# EAGLE design Particle-Gateway (EAGLE 7.3.0)
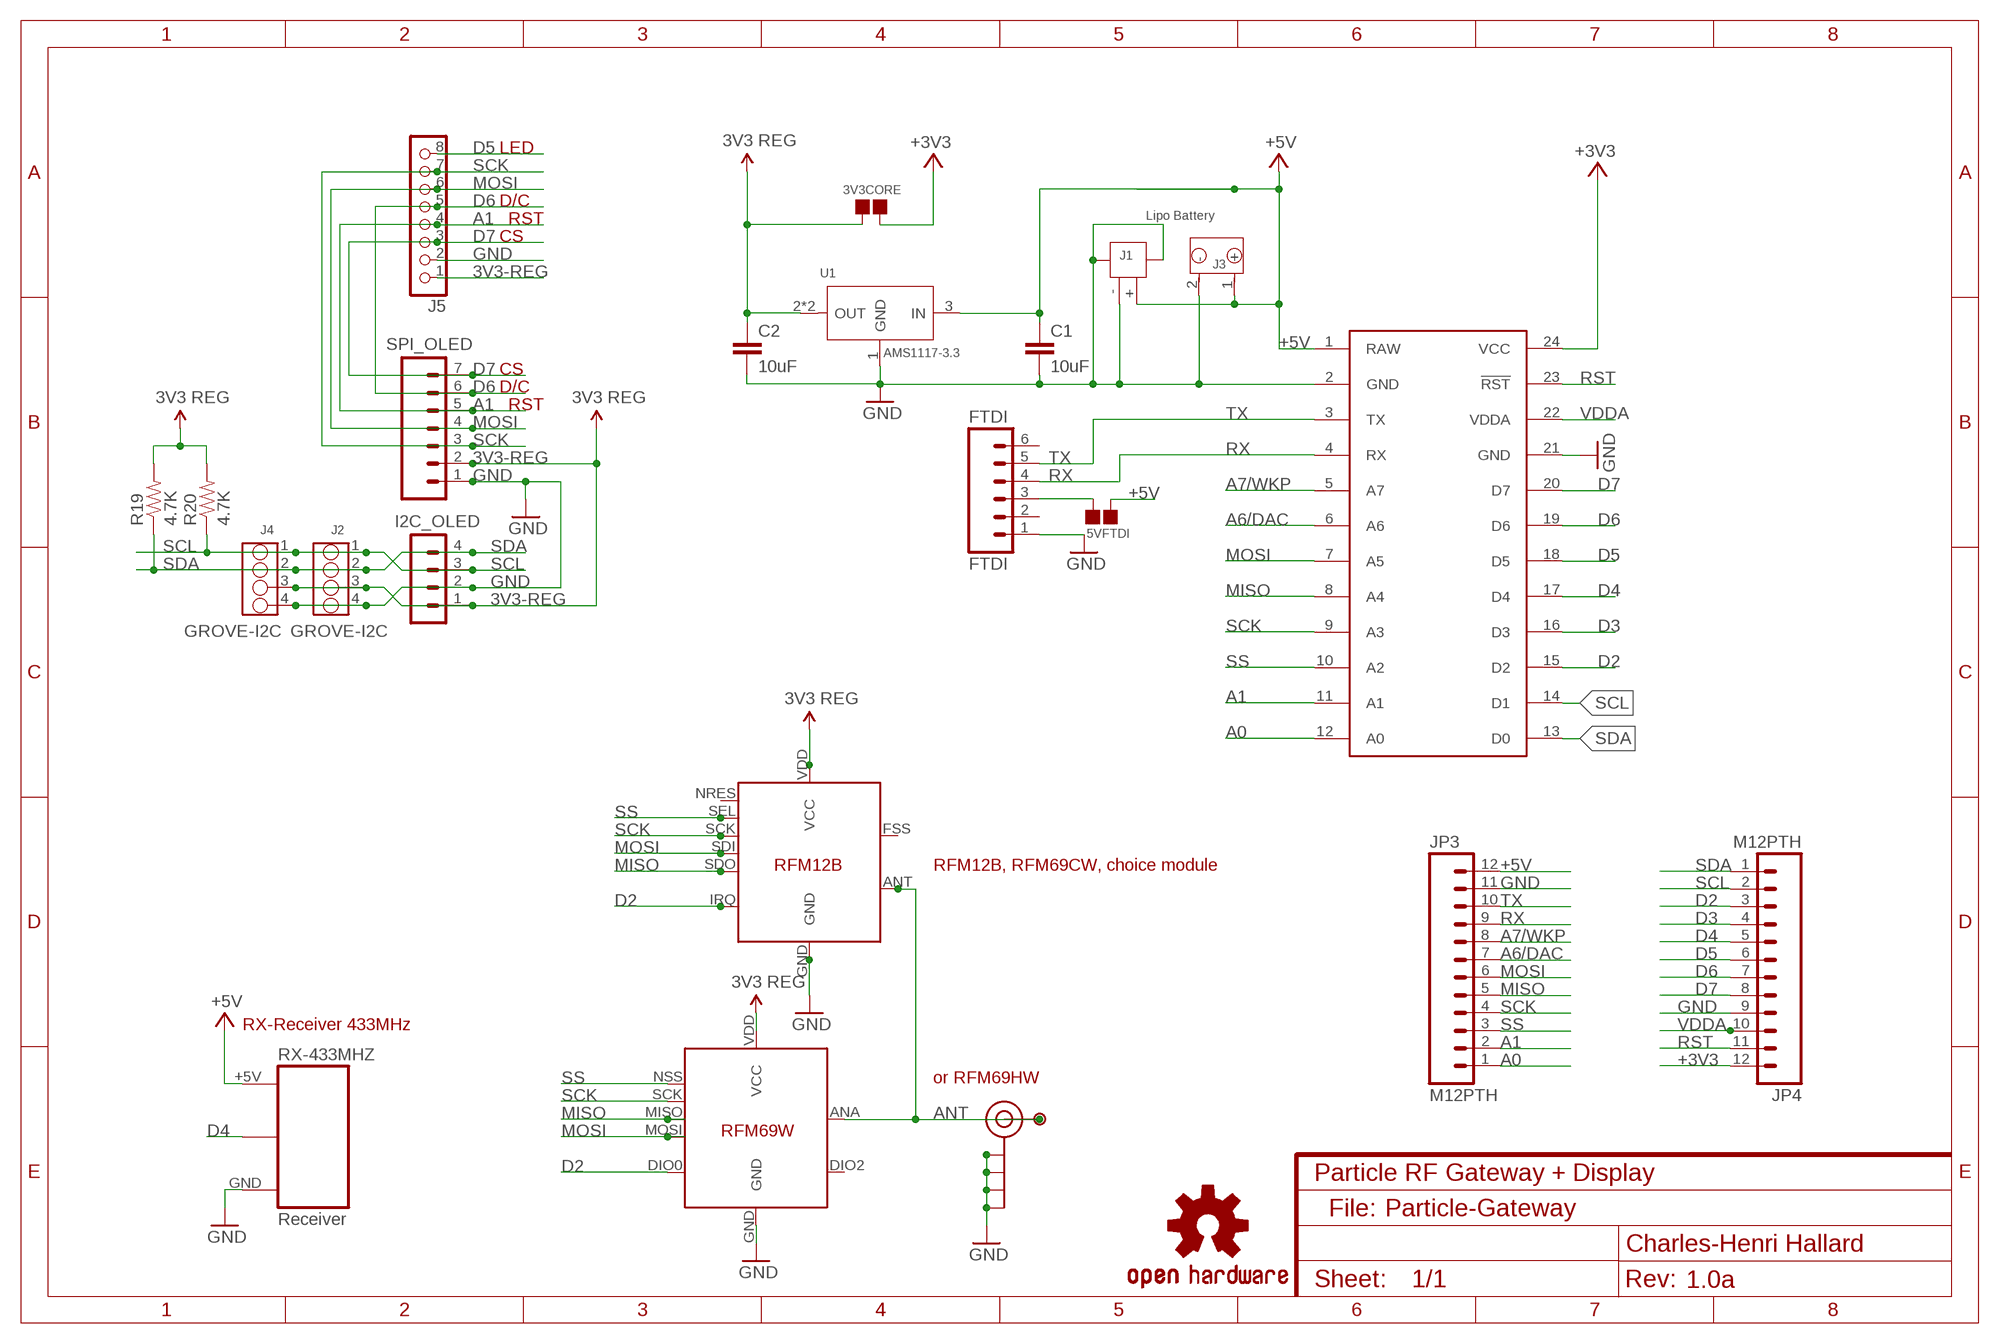
[diagram p0: schematic, sheet 1]
NAME (FRAME-A4L): CNAME: Particle RF Gateway + Display; CREVISION: 1.0a; DESIGNER: Charles-Henri Hallard

## Parts
3V3CORE  PAD-JUMPER-2P  [2P-SMD-1.78X1.27]
5VFTDI  PAD-JUMPER-2P  [2P-SMD-1.78X1.27]
C1  10uF  CAP0805-CAP  [0805-CAP]
C2  10uF  CAP0805-CAP  [0805-CAP]
FTDI  FTDI  M06SIP  [1X06]
I2C_OLED  CON_HEADER_1X04'SMALL''  [M1X4]
J1  JST-2P-SMD'2.0'  [2P-SMD-2.0-90D]
J2  GROVE-I2C  GROVE-4P-2.0-3470140P1  [4P-2.0-90D]
J3  Lipo Battery  JST-2P-PW-3410070P1  [2P-2.0-90D]
J4  GROVE-I2C  GROVE-4P-2.0-3470130P1  [4P-2.0]
J5  CON_HEADER_1X08-PTH  [M1X8]
J$1  SMA_EDGE  [SMA-EDGE]
JP3  M12PTH  [1X12-SMALL-PADS]
JP4  M12PTH  [1X12-SMALL-PADS]
LOGO2  OSHW-LOGOL  [OSHW-LOGO-L]
P1  PADSMALL  [PAD-SMALL]
R19  4.7K  RESISTOR0805-RES  [0805-RES]
R20  4.7K  RESISTOR0805-RES  [0805-RES]
RX-433MHZ  Receiver  RF-LINK_RX  [RF-LINK_RX_NO_SILK]
SPARKCORE  SPARK_CORECORE  [SPARK_CORE]
SPI_OLED  CON_HEADER_1X07'SMALL'  [M1X7]
U1  AMS1117-3.3  CJ1117-3.3-1310190P1  [SOT223]
U$2  RFM12B  [RFM12B-MINPADS]
U$3  RFM69W  [RFM69W-MINPADS]
U-FL  U.FL  [U.FL]

## Nets
3V3-REG: 3V3CORE.1 C2.1 I2C_OLED.1 J2.3 J4.3 J5.1 R19.2 R20.2 SPI_OLED.2 U1.2(OUT) U1.TER(OUT) U$2.VDD(VCC) U$3.VDD(VCC) ; supply symbol labelled 3V3 REG
+3V3: 3V3CORE.2 JP4.12 SPARKCORE.24(VCC)
+5V: 5VFTDI.1 C1.1 J1.+ J3.1(+) JP3.12 RX-433MHZ.+5V SPARKCORE.1(RAW) U1.3(IN)
A0: JP3.1 SPARKCORE.12(A0)
A1: J5.4 JP3.2 SPARKCORE.11(A1) SPI_OLED.5
A6/DAC: JP3.7 SPARKCORE.6(A6)
A7/WKP: JP3.8 SPARKCORE.5(A7)
ANT: J$1.SIG(SIGNAL) P1.1 U$2.ANT U$3.ANA(ANT) U-FL.3(SIGNAL)
D2: JP4.3 SPARKCORE.15(D2) U$2.IRQ U$3.DIO0
D3: JP4.4 SPARKCORE.16(D3)
D4: JP4.5 RX-433MHZ.DATA@1(DATA) RX-433MHZ.DATA@2(DATA) SPARKCORE.17(D4)
D5: J5.8 JP4.6 SPARKCORE.18(D5)
D6: J5.5 JP4.7 SPARKCORE.19(D6) SPI_OLED.6
D7: J5.3 JP4.8 SPARKCORE.20(D7) SPI_OLED.7
GND: C1.2 C2.2 FTDI.1 I2C_OLED.2 J1.3 J1.4 J1.- J2.4 J3.2(-) J4.4 J5.2 J$1.GND@0(GND) J$1.GND@1(GND) J$1.GND@2(GND) J$1.GND@3(GND) JP3.11 JP4.9 RX-433MHZ.GND SPARKCORE.2(GND) SPARKCORE.21(GND) SPI_OLED.1 U1.1(GND) U$2.GND U$3.GND U-FL.1(GND) U-FL.2(GND)
MISO: JP3.5 SPARKCORE.8(A4) U$2.SDO U$3.MISO
MOSI: J5.6 JP3.6 SPARKCORE.7(A5) SPI_OLED.4 U$2.SDI U$3.MOSI
N$1: 5VFTDI.2 FTDI.3
RST: JP4.11 SPARKCORE.23(!RST)
RX: FTDI.4 JP3.9 SPARKCORE.4(RX)
SCK: J5.7 JP3.4 SPARKCORE.9(A3) SPI_OLED.3 U$2.SCK U$3.SCK
SCL: I2C_OLED.3 J2.1 J4.1 JP4.2 R20.1 SPARKCORE.14(D1)
SDA: I2C_OLED.4 J2.2 J4.2 JP4.1 R19.1 SPARKCORE.13(D0)
SS: JP3.3 SPARKCORE.10(A2) U$2.SEL U$3.NSS(SEL)
TX: FTDI.5 JP3.10 SPARKCORE.3(TX)
VDDA: JP4.10 SPARKCORE.22(VDDA)
Unconnected: FTDI.2 FTDI.6 U$2.FSS(FFS) U$2.NRES U$3.DIO2

## Notes on the sheet
- LED
- D/C
- RST
- CS
- CS
- D/C
- RST
- RFM12B, RFM69CW, choice module
- RX-Receiver 433MHz
- or RFM69HW
- File:

## Library data of the parts
3V3CORE 5VFTDI = Seeed-Discrete:PAD-JUMPER-2P; PARTNO: DNP
C1 C2 = _c2h:CAP: Capacitor Standard 0603 ceramic capacitor, and 0.1" leaded capacitor.
FTDI = SparkFun-Connectors:M06: Header 6 Standard 6-pin 0.1" header. Use with straight break away headers (SKU : PRT-00116), right angle break away headers (PRT-00553), swiss pins (PRT-00743), machine pins (PRT-00117), and female headers (PRT-00115). Molex polarized connector foot print use with SKU : PRT-08094 with associated crimp pins and housings. NOTES ON THE VARIANTS LOCK and LOCK_LONGPADS... This footprint was designed to help hold the alignment of a through-hole component (i.e. 6-pin header) while soldering it into place. You may notice that each hole has been shifted either up or down by 0.005 of an inch from it's more standard position (which is a perfectly straight line). This slight alteration caused the pins (the squares in the middle) to touch the edges of the holes. Because they are alternating, it causes a "brace" to hold the component in place. 0.005 has proven to be the perfect amount of "off-center" position when using our standard breakaway headers. Although looks a little odd when you look at the bare footprint, once you have a header in there, the alteration is very hard to notice. Also, if you push a header all the way into place, it is covered up entirely on the bottom side. This idea of altering the position of holes to aid alignment will be further integrated into the Sparkfun Library for other footprints. It can help hold any component with 3 or more connection pins.
I2C_OLED = _c2h:CON_HEADER_1X04
J1 = Seeed-Connector:JST-2P-SMD: 2P-SMD-2.0-90D:320110026
J2 J4 = seeed-opl-Connector:GROVE-4P-2.0
J3 = Seeed-Connector:JST-2P-PW
J5 = dp_devices:CON_HEADER_1X08
J$1 = SparkFun-Connectors:SMA_EDGE: SMA Antenna Connector End launch SMA connector. The paste layer has been removed so that the connector can be hand soldered onto the board after reflow.
JP3 JP4 = Spark:M12: Header 12 Standard 12-pin 0.1" header. Use with straight break away headers (SKU : PRT-00116), right angle break away headers (PRT-00553), swiss pins (PRT-00743), machine pins (PRT-00117), and female headers (PRT-00115).
LOGO2 = SparkFun-Aesthetics:OSHW-LOGO: Open Source Hardware Logo This logo indicates the piece of hardware it is found on incorporates a OSHW license and/or adheres to the definition of open source hardware found here: http://freedomdefined.org/OSHW
P1 = SteveMarple:PAD
R19 R20 = _c2h:RESISTOR: Resistor Basic schematic elements and footprints for 0603, 1206, and PTH resistors.
RX-433MHZ = _c2h:RF-LINK_RX: RF Link receivers- WRL-8947, 8948, 8949, 8950, 10532, 10533
SPARKCORE = Spark:SPARK_CORE
SPI_OLED = _c2h:CON_HEADER_1X07
U1 = Seeed-IC:CJ1117-3.3: 1A Low Dropout Linear Regulator
U$2 = _c2h:RFM12B
U$3 = _c2h:RFM69W
U-FL = microbuilder:U.FL: U.FL Antenna Connector

## Net classes
0 default: width 0.203 mm, drill 0.356 mm, clearance 0.152 mm
1 power: width 0.203 mm, clearance 0.152 mm

## Board
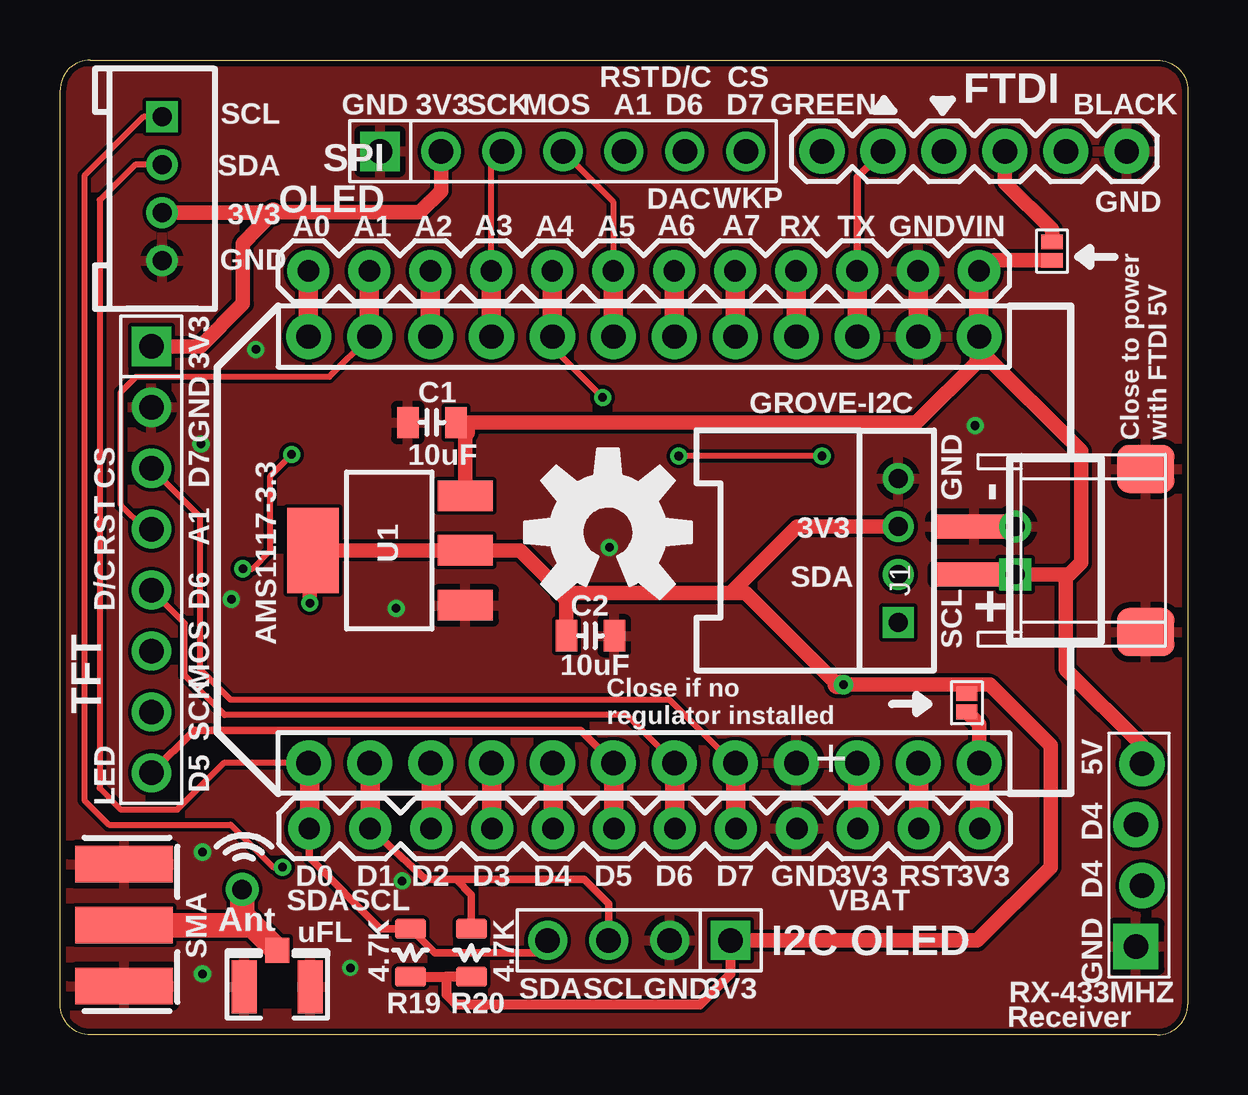
[diagram p1: board, top side]
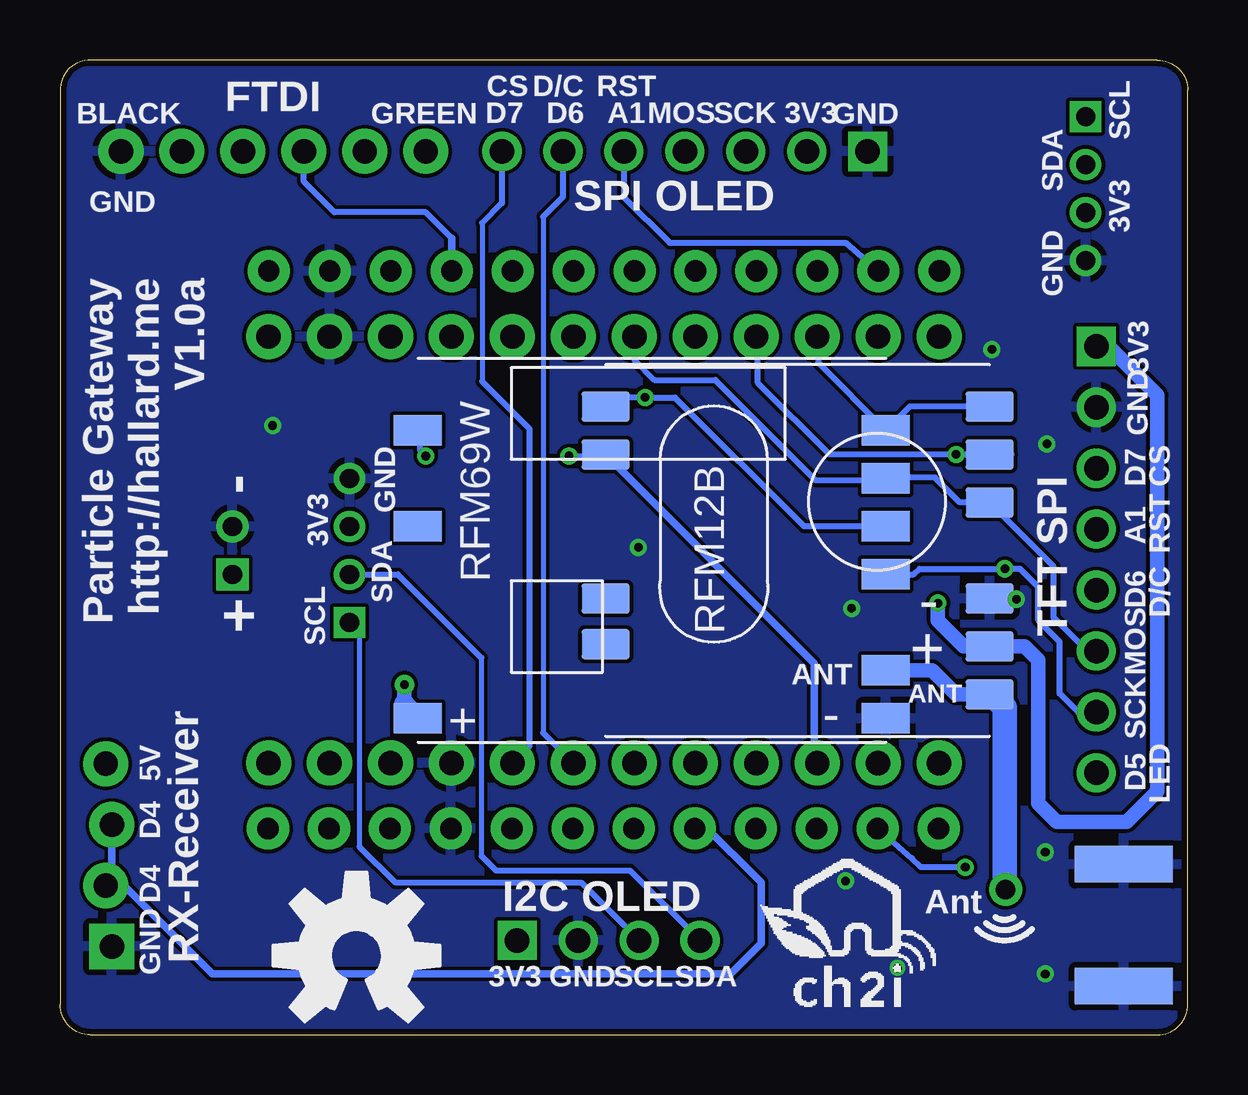
[diagram p2: board, bottom side, seen from below]

Size 46.99 x 40.64 mm. Coordinates in mm from the lower left corner, seen from the top.
Outline: 1.27,40.64 45.72,40.64 arc-90 46.99,39.37 46.99,1.27 arc-90 45.72,0 1.27,0 arc-90 0,1.27 0,39.37 arc-90 1.27,40.64
Copper layers (1*16): Top 0.035mm / dielectric 1.5mm / Bottom 0.035mm
Design rules "SeeedStudio_2layer_DRU_no_angle_20140221": minimum track width 6mil, minimum drill 12mil, track to track 6mil, track to pad 6mil, pad to pad 6mil, via to via 6mil, smd to smd 0mil, copper to edge 10mil, drill to drill 10mil, minimum pad ring 10mil, minimum via ring 6mil, stop-mask expansion 2mil, vias tented up to drill 100mil, thermal gap 10mil

### Footprints (pad centres in the part's own frame; a part is rotated, then mirrored left to right if it is on the bottom)
2P-SMD-1.78X1.27 = smd 0.889 x 0.61: 1 0,0.381; 2 0,-0.381
0805-CAP = smd 0.902 x 1.3: 1 -1,0; 2 1,0
1X06 = drill 1.016 pad 1.88: 1 0,0; 2 2.54,0; 3 5.08,0; 4 7.62,0; 5 10.16,0; 6 12.7,0
M1X4 = drill 1.02 pad 1.632 square: 1 -3.81,0 | drill 1.02 pad 1.632: 2 -1.27,0; 3 1.27,0; 4 3.81,0
2P-SMD-2.0-90D = smd 2 x 2.4: 3 3.4,-2.181; 4 -3.4,-2.181 | smd 1 x 3.6: + -1,4.953; - 1,4.953
4P-2.0-90D = drill 0.8 pad 1.27 square: 1 -3,0 | drill 0.8 pad 1.27: 2 -1,0; 3 1,0; 4 3,0
2P-2.0-90D = drill 0.8 pad 1.35 square: 1 -1,3.25 | drill 0.8 pad 1.35: 2 1,3.25
4P-2.0 = drill 0.8 pad 1.27 square: 1 -3,0 | drill 0.8 pad 1.27: 2 -1,0; 3 1,0; 4 3,0
M1X8 = drill 1.02 pad 1.632 square: 1 -8.89,0 | drill 1.02 pad 1.632: 2 -6.35,0; 3 -3.81,0; 4 -1.27,0; 5 1.27,0; 6 3.81,0; 7 6.35,0; 8 8.89,0
SMA-EDGE = smd 1.524 x 4.064: GND@0 0,0; GND@1 5.08,0; SIG 2.54,0 | smd 1.524 x 4.064 bottom: GND@2 0,0; GND@3 5.08,0
1X12-SMALL-PADS = drill 0.889 pad 1.753: 1 0,0; 2 2.54,0; 3 5.08,0; 4 7.62,0; 5 10.16,0; 6 12.7,0; 7 15.24,0; 8 17.78,0; 9 20.32,0; 10 22.86,0; 11 25.4,0; 12 27.94,0
PAD-SMALL = drill 0.813 pad 1.372: 1 0,0
0805-RES = smd 0.8 x 1.3: 1 -1,0; 2 1,0
RF-LINK_RX_NO_SILK = drill 1.016 pad 1.88: +5V 7.62,1.143; DATA@1 2.54,1.143; DATA@2 5.08,1.397 | drill 1.016 pad 1.88 square: GND 0,1.397
SPARK_CORE = drill 1.016 pad 1.88: 1 -8.89,13.97; 2 -8.89,11.43; 3 -8.89,8.89; 4 -8.89,6.35; 5 -8.89,3.81; 6 -8.89,1.27; 7 -8.89,-1.27; 8 -8.89,-3.81; 9 -8.89,-6.35; 10 -8.89,-8.89; 11 -8.89,-11.43; 12 -8.89,-13.97; 13 8.89,-13.97; 14 8.89,-11.43; 15 8.89,-8.89; 16 8.89,-6.35; 17 8.89,-3.81; 18 8.89,-1.27; 19 8.89,1.27; 20 8.89,3.81; 21 8.89,6.35; 22 8.89,8.89; 23 8.89,11.43; 24 8.89,13.97
M1X7 = drill 1.02 pad 1.632 square: 1 -6.35,0 | drill 1.02 pad 1.632: 2 -3.81,0; 3 -1.27,0; 4 1.27,0; 5 3.81,0; 6 6.35,0; 7 8.89,0
SOT223 = smd 1.27 x 2.286: 1 -2.286,-3.175; 2 0,-3.175; 3 2.286,-3.175 | smd 3.556 x 2.159: TER 0,3.175
RFM12B-MINPADS = smd 2 x 1.27: ANT 8,-6; FSS -8.002,-2; GND 8,-2; IRQ -8,4; NRES -8.002,-3.905; SCK 8,4; SDI 8,2; SDO -8,6; SEL 8,6; VDD 8,-4
RFM69W-MINPADS = smd 2 x 1.27: ANA 8,-5; DIO0 -11.5,5; DIO2 -11.5,1.012; GND 8,-7; MISO 8,1; MOSI 8,3; NSS 8,5; SCK 8,-1; VDD -11.5,-7
U.FL = smd 2.2 x 1.05: 1 0,1.375; 2 0,-1.375 | smd 1.05 x 1: 3 1.525,0

### Placement (x,y rotation side)
3V3CORE  37.78,13.84 0 top
5VFTDI  41.34,32.67 180 top
C1  15.49,25.53 180 top
C2  22.1,16.64 0 top
FTDI  44.45,36.83 180 top
I2C_OLED  24.13,3.94 180 top
J1  43.05,20.19 90 top
J2  34.92,20.19 90 top
J3  43.05,20.19 90 top
J4  4.25,35.27 270 top
J5  3.81,19.81 270 top
J$1  2.67,2.03 90 top
JP3  10.35,31.85 0 top
JP4  10.38,8.6 0 top
LOGO1  OSHW-LOGOL  [OSHW-LOGO-L]  22.83,20.95 0 top
LOGO2  34.64,3.3 0 bottom
P1  7.59,6.06 0 top
R19  14.61,3.43 270 top
R20  17.14,3.43 270 top
RX-433MHZ  46.23,3.68 90 top
SPARKCORE  24.33,20.22 270 top
SPI_OLED  19.68,36.83 0 top
U1  13.72,20.19 90 top
U$1  [LOGO_CH2I_75MM]  13.72,3.17 0 bottom
U$2  16.26,20.19 0 bottom
U$3  20.57,20.19 0 bottom
U-FL  9.05,2 90 top

### Tracks (layer width: path | path; a pad name or v marks a point on that pad's centre or on a via)
3V3-REG  (via drill 0.36 pad 0.71, 0.36 pad 0.81)
  Top 0.254: 16.11,2.43 16.1,2.41 16.08,2.43 | 37.78,14.29 3V3CORE.1
  Top 0.406: R20.2 16.11,2.43 | R19.2 16.08,2.43 | 16.1,2.41 16.1,1.68 16.51,1.27 26.67,1.27 27.94,2.54 I2C_OLED.1
  Top 0.61: I2C_OLED.1 38.23,3.94 41.27,6.99 41.27,12.06 38.73,14.61 37.81,14.61 | 37.81,14.61 v32.64,14.61 | J2.3 30.72,21.19 27.94,18.41 | 8.89,34.29 14.99,34.29 15.88,35.18 SPI_OLED.2 | U1.TER U1.2 19.18,20.19 20.95,18.41 27.94,18.41 | v10.41,18 10.41,20.07 | J4.3 8.87,34.27 7.62,32.99 7.62,30.48 5.84,28.7 J5.1 | 27.94,18.41 28.57,18.41 32.38,14.61 | C2.1 21.1,18.27 | 37.78,14.29 37.78,14.57 37.81,14.61
  Top 0.813: 10.41,20.07 U1.TER | 8.87,34.27 8.89,34.29 | 4.24,34.29 J4.3 | v32.64,14.61 32.38,14.61 | 21.1,18.27 20.95,18.41
  Bottom 0.61: 32.65,13.83 v32.64,14.61 | v10.41,18 10.41,17.27 9.34,16.19 U$2.VDD 6.79,16.19 6.22,15.62 6.22,9.65 5.46,8.89 2.54,8.89 1.27,10.16 1.27,26.67 3.3,28.7 J5.1
  Bottom 0.813: U$3.VDD 32.65,13.83
+3V3
  Top 0.61: SPARKCORE.24 38.3,12.94 3V3CORE.2
  Top 0.813: JP4.12 38.32,11.31 SPARKCORE.24
+5V
  Top 0.61: C1.1 35.69,25.53 38.3,28.14 | U1.3 16.89,25.13 | J3.1 41.91,19.19 | 41.91,19.19 42.05,19.19 42.55,19.68 42.55,24.33 38.3,28.57 | RX-433MHZ.+5V 45.09,12.06 41.91,15.24 41.91,19.19 | 5VFTDI.1 38.92,32.29 JP3.12
  Top 0.813: JP3.12 SPARKCORE.1 38.3,28.57 38.3,28.14 | 16.89,25.13 C1.1 | J3.1 J1.+
A0
  Top 0.406: 10.32,29.15 SPARKCORE.12
  Top 0.813: JP3.1 SPARKCORE.12
A1
  Top 0.254: 12.7,28.91 SPARKCORE.11 11.22,27.43 3.17,27.43 2.54,26.8 2.54,22.1 3.56,21.08 J5.4
  Top 0.406: 12.86,29.15 SPARKCORE.11
  Top 0.813: JP3.2 SPARKCORE.11
  Bottom 0.254: SPI_OLED.5 23.5,34.92 21.59,33.02 14.26,33.02 JP3.2
A6/DAC
  Top 0.406: 25.56,29.15 SPARKCORE.6
  Top 0.813: JP3.7 SPARKCORE.6
A7/WKP
  Top 0.406: 28.1,29.15 SPARKCORE.5
  Top 0.813: JP3.8 SPARKCORE.5
ANT
  Top 1.016: J$1.SIG 8,4.57 | 8,4.57 U-FL.3 | P1.1 7.59,4.99 8,4.57
  Bottom 0.61: U$2.ANT 9.65,14.19 10.65,15.19 U$3.ANA
  Bottom 1.016: U$2.ANT 8.16,14.19 7.62,13.65 7.62,6.1 P1.1
D2  (via drill 0.36 pad 0.71)
  Top 0.254: v31.75,24.13 v25.78,24.13
  Top 0.406: 15.46,11.31 SPARKCORE.15
  Top 0.813: JP4.3 15.46,11.31
  Bottom 0.254: 31.99,25.27 31.99,24.37 v31.75,24.13 | v25.78,24.13 24.32,24.13
  Bottom 0.305: 15.55,11.33 15.55,15.49 U$2.IRQ
  Bottom 0.406: SPARKCORE.15 15.55,11.33 | 31.99,25.27 U$3.DIO0 | 24.32,24.13 U$2.IRQ
D3
  Top 0.406: 17.98,8.82 JP4.4
  Top 0.813: 17.98,8.82 SPARKCORE.16
D4
  Top 0.406: 20.54,11.31 SPARKCORE.17
  Top 0.813: JP4.5 20.54,11.31
  Bottom 0.305: RX-433MHZ.DATA@1 44.83,6.48 RX-433MHZ.DATA@2 44.83,6.73 40.64,2.54 19.05,2.54 17.78,3.81 17.78,6.35 20.23,8.79 JP4.5
D5
  Top 0.305: SPARKCORE.18 21.69,12.7 5.59,12.7 J5.8
  Top 0.406: 23.15,11.24 SPARKCORE.18 23.08,11.31
  Top 0.813: JP4.6 23.08,11.31
D6
  Top 0.254: SPARKCORE.19 25.6,11.36 23.62,13.34 6.86,13.34 5.21,14.99 5.21,17.14 J5.5
  Top 0.406: 25.62,11.31 SPARKCORE.19
  Top 0.813: JP4.7 25.62,11.31
  Bottom 0.203: 26.86,34.1 26.86,12.59
  Bottom 0.254: 25.65,11.38 SPARKCORE.19 26.86,12.59 | SPI_OLED.6 26.04,34.92 26.86,34.1
D7
  Top 0.254: SPARKCORE.20 28.04,11.33 25.4,13.97 7.11,13.97 5.84,15.24 5.84,21.59 J5.3
  Top 0.406: 28.16,11.31 SPARKCORE.20
  Top 0.813: JP4.8 28.16,11.31
  Bottom 0.203: 29.4,33.85 29.4,27.24
  Bottom 0.254: SPI_OLED.7 28.57,34.67 29.4,33.85 | 29.4,27.24 27.43,25.27 27.43,12.04 SPARKCORE.20
GND  (via drill 0.36 pad 0.61, 0.36 pad 0.71)
  Top 0.406: SPARKCORE.2
  Top 0.813: JP3.11 SPARKCORE.2
  other vias: 38.13,25.4 14.26,6.41 12.1,2.79 5.87,24.64 22.89,20.32 14,17.78 7.14,18.16 8.16,28.57 5.94,7.62 5.94,2.54
  pour Bottom: 49.53,43.18 49.53,-2.54 -0.76,-2.67 -0.76,43.05
  pour Top: -2.16,41.78 48.26,41.91 48.26,-1.27 -2.16,-1.4
MISO  (via drill 0.36 pad 0.71)
  Top 0.254: SPARKCORE.8 20.51,28.67 v22.61,26.57
  Top 0.406: 20.48,29.15 SPARKCORE.8
  Top 0.813: JP3.5 SPARKCORE.8
  Bottom 0.254: U$3.MISO 15.99,21.19 21.37,26.57 v22.61,26.57 23.88,26.57
  Bottom 0.406: 12.84,21.46 U$3.MISO | 23.88,26.57 U$2.SDO
MOSI
  Top 0.254: SPI_OLED.4 23.05,34.73 JP3.6
  Top 0.406: 23.02,29.15 SPARKCORE.7
  Top 0.813: JP3.6 23.06,31.66 SPARKCORE.7
  Bottom 0.254: 12.53,23.24 10.54,23.24 9.49,22.19 U$2.SDI 5.59,19.52 5.59,17.4 4.19,16 J5.6 | 12.65,23.11 15.49,23.11 19.68,27.3 22.23,27.3 23.05,28.13 SPARKCORE.7
  Bottom 0.406: 12.53,23.24 U$3.MOSI 12.65,23.11 | SPARKCORE.7
N$1
  Top 0.61: FTDI.3 39.37,35.53 41.34,33.56 41.34,33.18 5VFTDI.2
RST
  Top 0.406: 35.78,11.31 SPARKCORE.23
  Top 0.813: JP4.11 35.78,11.31
RX
  Top 0.406: SPARKCORE.4
  Top 0.813: JP3.9 SPARKCORE.4
  Bottom 0.254: 30.67,33.21 31.75,34.29 35.56,34.29 36.83,35.56 FTDI.4
  Bottom 0.305: JP3.9 30.67,33.21
SCK  (via drill 0.36 pad 0.71)
  Top 0.254: JP3.4 17.97,36.39 SPI_OLED.3 | v7.62,19.43 8,19.43 8.76,20.19 8.76,23.3 v9.65,24.19
  Top 0.406: 17.94,29.15 SPARKCORE.9
  Top 0.813: JP3.4 SPARKCORE.9
  Bottom 0.254: 8.79,24.19 v9.65,24.19 | v9.65,24.19 14.92,24.19 17.91,27.18 17.91,29.04 SPARKCORE.9 | 8.19,24.26 U$2.SCK | v9.65,24.19 7.68,24.19 7.62,24.13 7.62,24.19 | U$3.SCK 11.41,19.19 11.18,19.43 v7.62,19.43 6.99,19.43 6.22,18.67 6.22,17.27 5.33,16.38 5.33,14.22 4.57,13.46 J5.7
  Bottom 0.305: SPARKCORE.9 17.97,28.26
  Bottom 0.406: 7.43,24.19 7.62,24.19 U$2.SCK 8.79,24.19 | SPARKCORE.9
SCL  (via drill 0.36 pad 0.71)
  Top 0.254: J4.1 3.48,38.27 1.02,35.81 1.02,9.78 2.03,8.76 7.11,8.76 8.89,6.99 v9.27,6.99
  Top 0.305: 16.51,6.48 21.84,6.48 22.86,5.46 I2C_OLED.3 | 16.51,6.48 15.24,6.48 JP4.2 | R20.1 17.14,5.84 16.51,6.48
  Top 0.406: 12.92,11.31 SPARKCORE.14
  Top 0.813: JP4.2 12.92,11.31
  Bottom 0.203: 34.51,16.78 34.51,7.84
  Bottom 0.254: 34.51,7.84 33.02,6.35 25.27,6.35 I2C_OLED.3 | 34.51,16.78 J2.1 | JP4.2 11.49,7.37 11.11,6.99 v9.27,6.99
  Bottom 0.305: 12.95,8.76 JP4.2
SDA
  Top 0.254: J4.2 3.13,36.27 1.65,34.8 1.65,10.29 2.54,9.4 4.89,9.4 6.82,11.33 SPARKCORE.13
  Top 0.305: JP4.1 10.38,7.4 13.35,4.43 R19.1 15.61,3.43 19.81,3.43 I2C_OLED.4
  Top 0.406: 10.38,11.31 SPARKCORE.13 10.41,11.28 | JP4.1 10.38,8.76 10.41,8.73
  Top 0.813: 10.41,8.73 10.41,11.28
  Bottom 0.203: 29.43,15.72 29.43,7.46
  Bottom 0.254: J2.2 32.91,19.19 29.43,15.72 | 29.43,7.46 28.83,6.86 23.24,6.86 I2C_OLED.4
SS
  Top 0.406: 15.4,29.15 SPARKCORE.10
  Top 0.813: JP3.3 SPARKCORE.10
  Bottom 0.254: U$2.SEL 11.57,26.19 U$3.NSS 15.4,28.02 15.4,29.15
  Bottom 0.406: 15.4,29.15 15.44,29.15 SPARKCORE.10
TX
  Top 0.305: JP3.10 33.21,35.75 FTDI.5
  Top 0.406: SPARKCORE.3
  Top 0.813: JP3.10 SPARKCORE.3
VDDA
  Top 0.406: 33.24,11.31 SPARKCORE.22
  Top 0.813: JP4.10 33.24,11.31

### Text on the board
tPlace: SMA | uFL
tNames: RST | D/C | CS | SCL | GND | 3V3 | SCK | MOS | A1 | D6 | D7 | GREEN | BLACK | SDA | SPI / OLED | 3V3 | GND | DAC | WKP | A0 | A1 | A2 | A3 | A4 | A5 | A6 | A7 | RX | TX | GND | VIN | GND | 3V3 | GND | CS | Close to power / with FTDI 5V | D7 | - | RST | A1 | GND | 3V3 | D/C | SDA | D6 | + | TFT | MOS | SCL | SCK | Close if no / regulator installed | LED | D5 | 5V | + | D4 | D4 | D0 | D1 | D2 | D3 | D4 | D5 | D6 | D7 | GND | 3V3 | RST | 3V3 | Ant | SDA | SCL | VBAT | GND | I2C OLED | SDA | SCL | GND | 3V3
bNames: GND | 3V3 | SCK | MOS | A1 | RST | D6 | D/C | D7 | CS | GREEN | FTDI | BLACK | SCL | 3V3 | SDA | GND | GND | SPI OLED | V1.0a | Particle Gateway / http://hallard.me | 3V3 | GND | GND | CS | D7 | TFT SPI | 3V3 | - | RST | A1 | D6 | SDA | + | D/C | SCL | MOS | RX-Receiver | SCK | 5V | LED | D5 | D4 | Ant | I2C OLED | D4 | GND | SDA | SCL | GND | 3V3